# EAGLE design rgb-led-cc-driver-mk-2.0 (EAGLE 6.5.0)
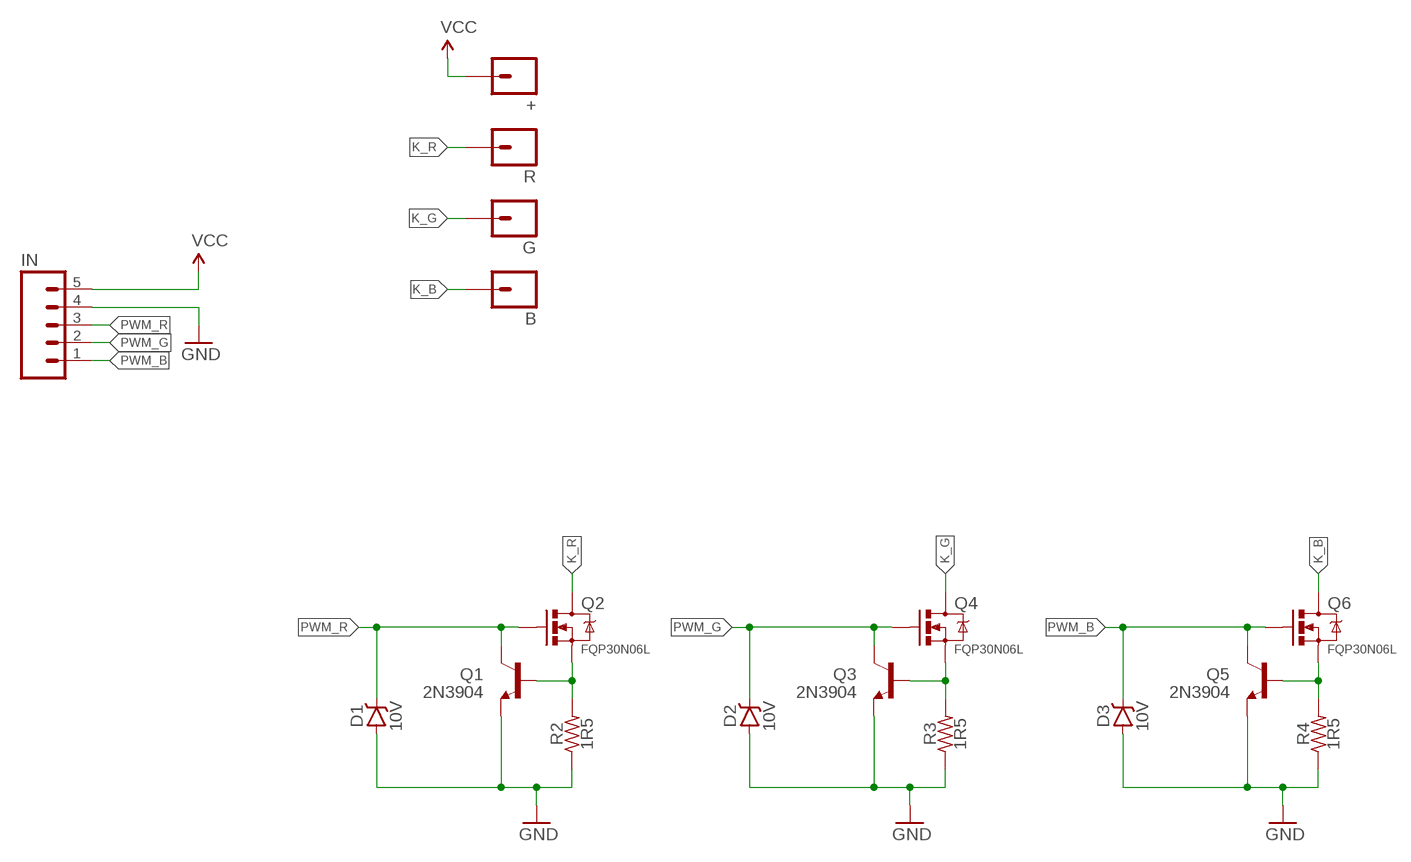
[diagram p0: schematic, sheet 1]

## Parts
+  M01PTH_2MM  [1X01_2MM]
B  M01PTH_2MM  [1X01_2MM]
D1  10V  DIODE-ZENER7.62MM-PTH  [DIODE-ZENNER-7.62MM]
D2  10V  DIODE-ZENER7.62MM-PTH  [DIODE-ZENNER-7.62MM]
D3  10V  DIODE-ZENER7.62MM-PTH  [DIODE-ZENNER-7.62MM]
G  M01PTH_2MM  [1X01_2MM]
IN  M05PTH  [1X05]
Q1  2N3904  TRANSISTOR_NPNTO-92-AMMO-EBC  [TO-92-AMMO]
Q2  FQP30N06L  MOSFET-NCHANNELFQP30N06L-THERM-OFFSET  [TO220-THERMPAD-OFFSETPADS]
Q3  2N3904  TRANSISTOR_NPNTO-92-AMMO-EBC  [TO-92-AMMO]
Q4  FQP30N06L  MOSFET-NCHANNELFQP30N06L-THERM-OFFSET  [TO220-THERMPAD-OFFSETPADS]
Q5  2N3904  TRANSISTOR_NPNTO-92-AMMO-EBC  [TO-92-AMMO]
Q6  FQP30N06L  MOSFET-NCHANNELFQP30N06L-THERM-OFFSET  [TO220-THERMPAD-OFFSETPADS]
R  M01PTH_2MM  [1X01_2MM]
R2  1R5  RESISTORPTH-AXIAL-10.16MM  [RESISTOR-AXIAL-PTH-10.16MM]
R3  1R5  RESISTORPTH-AXIAL-10.16MM  [RESISTOR-AXIAL-PTH-10.16MM]
R4  1R5  RESISTORPTH-AXIAL-10.16MM  [RESISTOR-AXIAL-PTH-10.16MM]

## Nets
GND: D1.A D2.A D3.A IN.4 Q1.1(E) Q3.1(E) Q5.1(E) R2.P$1 R3.P$1 R4.P$1
K_B: B.1 Q6.2@2(D)
K_G: G.1 Q4.2@2(D)
K_R: Q2.2@2(D) R.1
N$1: Q1.2(B) Q2.3(S) R2.P$2
N$2: Q3.2(B) Q4.3(S) R3.P$2
N$3: Q5.2(B) Q6.3(S) R4.P$2
PWM_B: D3.K(C) IN.1 Q5.3(C) Q6.1(G)
PWM_G: D2.K(C) IN.2 Q3.3(C) Q4.1(G)
PWM_R: D1.K(C) IN.3 Q1.3(C) Q2.1(G)
VCC: +.1 IN.5

## Library data of the parts
+ B G R = A_butts:M01: Header 1 Standard 1-pin 0.1" header. Use with straight break away headers (SKU : PRT-00116), right angle break away headers (PRT-00553), swiss pins (PRT-00743), machine pins (PRT-00117), and female headers (PRT-00115).
D1-D3 = A_butts:DIODE-ZENER: Zener Diode Production Part - 8199 3.4V Zener Voltage
IN = A_butts:M05: Header 5 Standard 5-pin 0.1" header. Use with straight break away headers (SKU : PRT-00116), right angle break away headers (PRT-00553), swiss pins (PRT-00743), machine pins (PRT-00117), and female headers (PRT-00115). Molex polarized connector foot print use with SKU : PRT-08230 with associated crimp pins and housings.
Q1 Q3 Q5 = A_butts:TRANSISTOR_NPN: Generic NPN BJT MMBT2222A - TRANS-08049 (SOT-23, 1A 40V) MPSA42 - TRANS-09116 (SOT-23, 500mA 300V) MMBT5088LT1G - TRANS-11160 (SOT-23, 50 mA 30V) BC547 - COM-08928 <http://www.sparkfun.com/products/8928> (TO-92 45V 100mA) (1.Collector 2.Base 3.Emitter) 2N3904 - COM-00521 <http://www.sparkfun.com/products/521> (TO-92 40V 200mA) (1.Emitter 2.Base 3.Collector) P2N2222A - COM-12852 <http://www.sparkfun.com/products/12852> (TO-92 40V 600mA) (1.Collector 2.Base 3.Emitter)
Q2 Q4 Q6 = A_butts:MOSFET-NCHANNEL: Common NMOSFET Parts MFG P/N Store ID Prod ID FDD8780 TRANS-09984 SI7820DN TRANS-11055 FDS6630A IC-08089 2N7002PW TRANS-11151 FQP30N06L COM-10213 TRANS-10060 BSS123LT1G TRANS-08345 BSS138 TRANS-00830 BS170 2N7000
R2-R4 = A_butts:RESISTOR: RESISTOR, American symbol

## Board
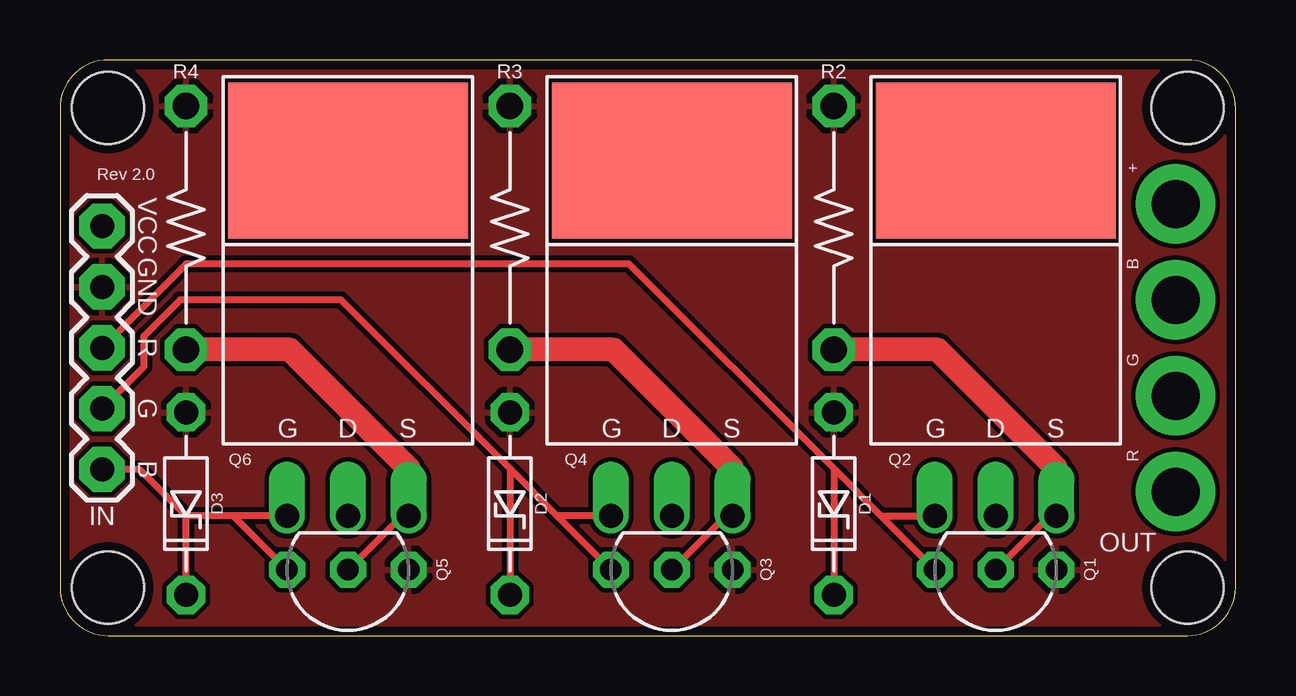
[diagram p1: board, top side]
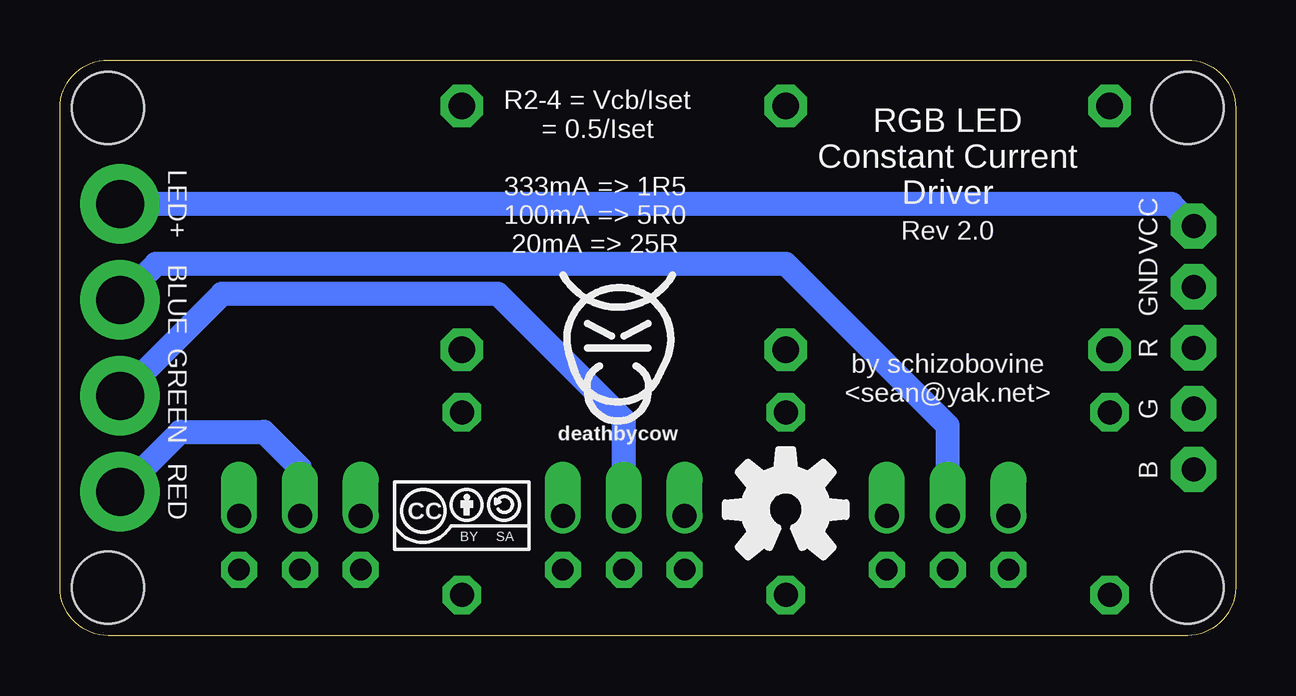
[diagram p2: board, bottom side, seen from below]

Size 49 x 24 mm. Coordinates in mm from the lower left corner, seen from the top.
Outline: 2,0 47,0 arc90 49,2 49,22 arc90 47,24 2,24 arc90 0,22 0,2 arc90 2,0
Copper layers (1*16): Top 0.0356mm / dielectric 1.5011mm / Bottom 0.0356mm
Design rules "LaenPCBOrder2": minimum track width 6mil, minimum drill 13mil, track to track 6mil, track to pad 6mil, pad to pad 6mil, via to via 6mil, smd to smd 6mil, copper to edge 15mil, drill to drill 6mil, minimum pad ring 7mil, minimum via ring 7mil, stop-mask expansion 3mil, vias tented up to drill 20mil, thermal gap 10mil
Holes 3 mm at 2,2 47,2 2,22 47,22

### Footprints (pad centres in the part's own frame; a part is rotated, then mirrored left to right if it is on the bottom)
1X01_2MM = drill 2 pad 3.302: 1 0,0
DIODE-ZENNER-7.62MM = drill 1 pad 1.6 octagon: A -3.81,0; K 3.81,0
1X05 = drill 1 pad 1.88 octagon: 1 0,0; 2 2.54,0; 3 5.08,0; 4 7.62,0; 5 10.16,0
TO-92-AMMO = drill 0.9 pad 1.5 octagon: 1 -2.54,0; 2 0,0; 3 2.54,0
TO220-THERMPAD-OFFSETPADS = drill 1 offset: 1 -2.54,0; 2@2 0,0; 3 2.54,0 | smd 10 x 6.5: 2@1 0,14.81
RESISTOR-AXIAL-PTH-10.16MM = drill 1.1 pad 1.778 octagon: P$1 -5.08,0; P$2 5.08,0

### Placement (x,y rotation side)
+  46.5,18 180 top
B  46.5,14 180 top
D1  32.25,5.5 270 top
D2  18.75,5.5 270 top
D3  5.25,5.5 270 top
G  46.5,10 180 top
IN  1.75,6.92 90 top
Q1  39,2.75 180 top
Q2  39,5 0 top
Q3  25.5,2.75 180 top
Q4  25.5,5 0 top
Q5  12,2.75 180 top
Q6  12,5 0 top
R  46.5,6 180 top
R2  32.25,17 270 top
R3  18.75,17 270 top
R4  5.25,17 270 top
U$1  [CC-BY-SA-4.0-NO-URL]  32.25,5 0 bottom
U$2  [COW_SMALL]  25.75,12.5 0 bottom
U$3  [OSHWLOGO_BOT_0.2_A]  18.75,5.25 0 top

### Tracks (layer width: path | path; a pad name or v marks a point on that pad's centre or on a via)
GND
  pour Top (isolate 0.2): 2,24 47,24 arc-90 49,22 49,2 arc-90 47,0 2,0 arc-90 0,2 0,22 arc-90
K_B
  Bottom 1: Q6.2@2 12,8.75 18.75,15.5 45,15.5 B.1
K_G
  Bottom 1: Q4.2@2 25.5,9 30.75,14.25 42.25,14.25 G.1
K_R
  Bottom 1: R.1 44,8.5 40.5,8.5 39,7 Q2.2@2
N$1
  Top 0.3: Q1.2 41.25,5 Q2.3
  Top 1: Q2.3 41.5,5.04 41.5,7 36.58,11.92 R2.P$2
N$2
  Top 0.3: Q3.2 27.75,5 Q4.3
  Top 1: Q4.3 28,5.04 28,7 23.08,11.92 R3.P$2
N$3
  Top 0.3: Q5.2 14.25,5 Q6.3
  Top 1: Q6.3 14.54,6.96 9.58,11.92 R4.P$2
PWM_B
  Top 0.3: Q6.1 7.21,5 | Q5.3 7.21,5 | 7.21,5 5.25,5 | D3.K 5.25,5 | 5.25,5 3.33,6.92 IN.1
PWM_G
  Top 0.3: IN.2 3.5,11.21 3.5,12.5 5,14 11.71,14 18.75,6.96 | Q4.1 20.71,5 | 18.75,6.96 D2.K | Q3.3 20.71,5 | 18.75,6.96 20.71,5
PWM_R
  Top 0.3: 32.25,6.96 D1.K | 32.25,6.96 23.71,15.5 5.25,15.5 IN.3 | 32.25,6.96 34.21,5 | 34.21,5 Q2.1 | Q1.3 34.21,5
VCC
  Bottom 1: IN.5 2.67,18 +.1

### Text on the board
tPlace: VCC | GND | R | G | G | D | S | G | D | S | G | D | S | B | OUT
bPlace: R2-4 = Vcb/Iset / = 0.5/Iset / / 333mA => 1R5 / 100mA => 5R0 / 20mA => 25R | RGB LED / Constant Current / Driver | LED+ | VCC | GND | BLUE | R | by schizobovine / <sean@yak.net> | GREEN | G | B | RED